# EAGLE schematic 1 Strain Gauge Board (EAGLE 9.1.3)
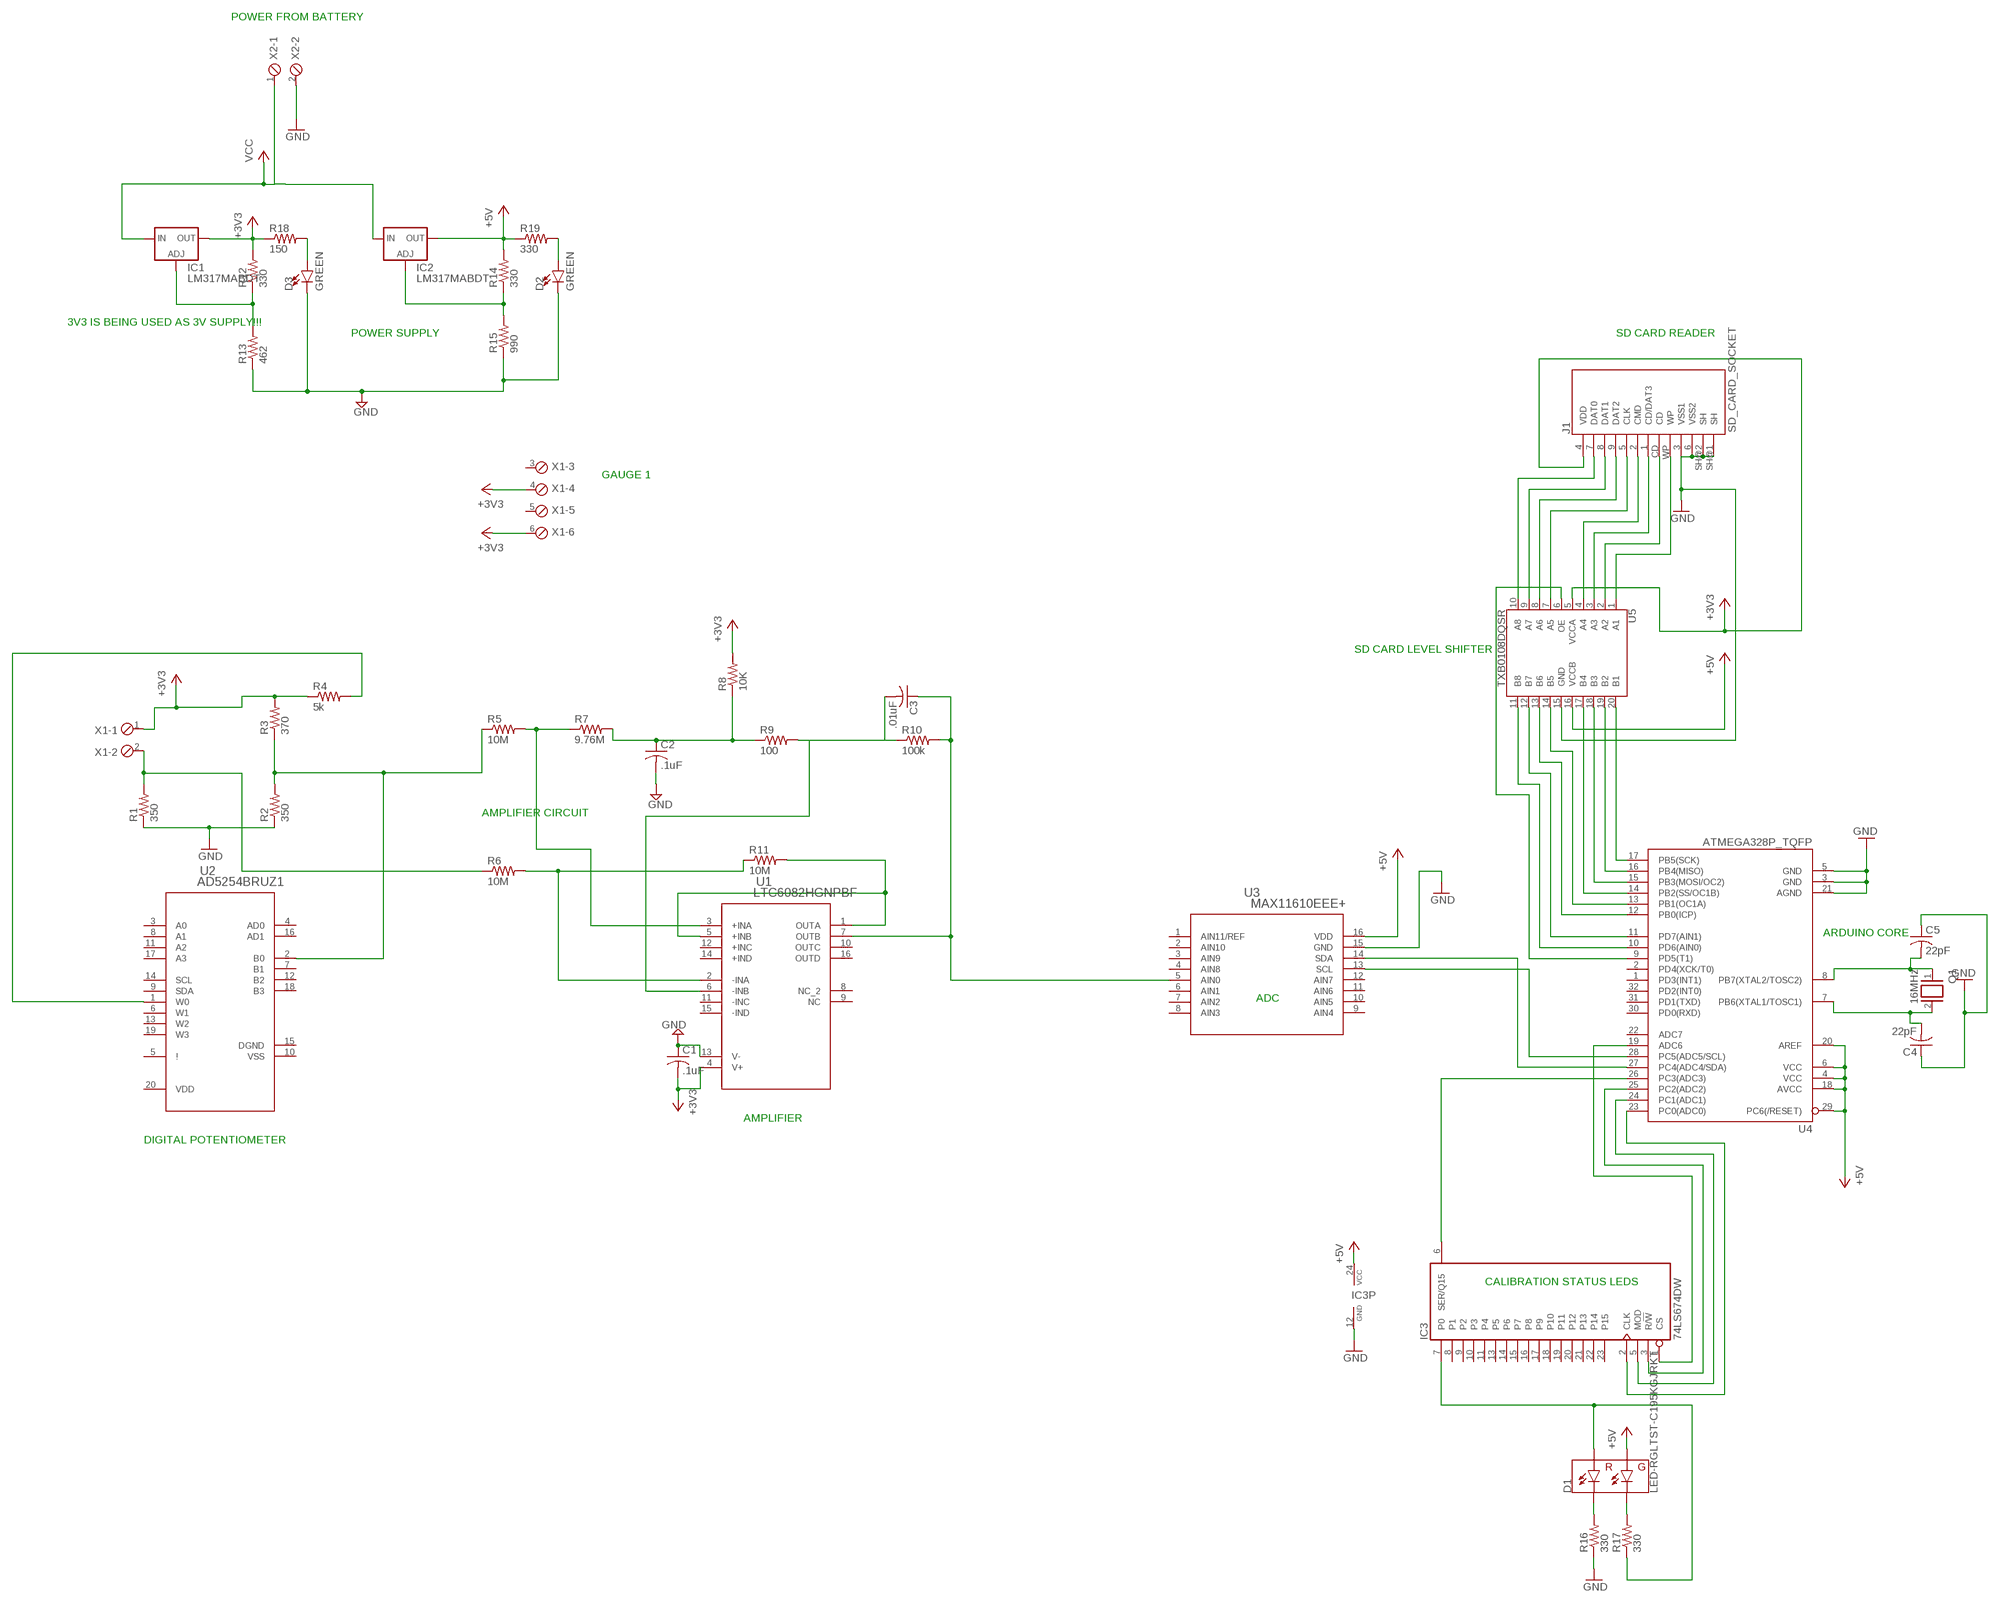
[diagram p0: schematic, sheet 1]

## Parts
C1  .1uF  C-USC1206K  [C1206K]
C2  .1uF  C-USC1206K  [C1206K]
C3  .01uF  C-USC1206K  [C1206K]
C4  22pF  C-USC1206K  [C1206K]
C5  22pF  C-USC1206K  [C1206K]
D1  LED-RGLTST-C195KGJRKT  [LTST-C195KGJRKT]
D2  GREEN  LED-GREEN1206  [LED-1206]
D3  GREEN  LED-GREEN1206  [LED-1206]
IC1  LM317MABDT  [DPACK]
IC2  LM317MABDT  [DPACK]
IC3  74LS674DW  [SO24W]
J1  SD_CARD_SOCKET  [SD]
Q1  16MHz  XTAL/S  [QS]
R1  350  R-US_M1206  [M1206]
R2  350  R-US_M1206  [M1206]
R3  370  R-US_M1206  [M1206]
R4  5k  R-US_M1206  [M1206]
R5  10M  R-US_M1206  [M1206]
R6  10M  R-US_M1206  [M1206]
R7  9.76M  R-US_M1206  [M1206]
R8  10K  R-US_M1206  [M1206]
R9  100  R-US_M1206  [M1206]
R10  100k  R-US_M1206  [M1206]
R11  10M  R-US_M1206  [M1206]
R12  330  R-US_M1206  [M1206]
R13  462  R-US_M1206  [M1206]
R14  330  R-US_M1206  [M1206]
R15  990  R-US_M1206  [M1206]
R16  330  R-US_M1206  [M1206]
R17  330  R-US_M1206  [M1206]
R18  150  R-US_M1206  [M1206]
R19  330  R-US_M1206  [M1206]
U1  LTC6082HGNPBF  [SSOP-16_GN]
U2  AD5254BRUZ1  [RU_20]
U3  MAX11610EEE+  [21-0055H_16]
U4  ATMEGA328P_TQFP  [TQFP32-08]
U5  TXB0108DQSR  TXB0108  [UFDFN-20]
X1  MPT6  [6POL254]
X2  MPT2  [2POL254]

## Nets
+3V3: C1.2 IC1.4(OUT) J1.4(VDD) R3.2 R4.1 R8.2 R12.2 R18.1 U1.4(V+) U5.5(VCCA) X1.1 X1.4 X1.6
+5V: D1.P$1(GA) IC2.4(OUT) IC3.24(VCC) R14.2 R19.1 U3.16(VDD) U4.4(VCC) U4.6(VCC) U4.18(AVCC) U4.20(AREF) U4.29(PC6(/RESET)) U5.16(VCCB)
GND: C1.1 C2.2 C4.1 C5.1 D2.C D3.C IC3.12(GND) J1.3(VSS1) J1.6(VSS2) J1.SH@1(SH) J1.SH@2(SH) R1.1 R2.1 R13.1 R15.1 R16.1 U1.13(V-) U3.15(GND) U4.3(GND) U4.5(GND) U4.21(AGND) U5.15(GND) X2.2
N$1: R2.2 R3.1 R5.1 U2.2(B0)
N$2: R1.2 R6.1 X1.2
N$3: R6.2 R11.1 U1.2(-INA)
N$4: R11.2 U1.1(OUTA) U1.5(+INB)
N$5: R4.2 U2.1(W0)
N$6: R5.2 R7.1 U1.3(+INA)
N$7: C2.1 R7.2 R8.1 R9.1
N$8: C3.2 R9.2 R10.1 U1.6(-INB)
N$9: C3.1 R10.2 U1.7(OUTB) U3.5(AIN0)
N$10: U3.14(SDA) U4.27(PC4(ADC4/SDA))
N$11: U3.13(SCL) U4.28(PC5(ADC5/SCL))
N$12: IC1.1(ADJ) R12.1 R13.2
N$13: J1.1(CD/DAT3) U5.3(A3)
N$14: IC2.1(ADJ) R14.1 R15.2
N$15: J1.WP U5.1(A1)
N$16: U4.9(PD5(T1)) U5.6(OE)
N$17: J1.CD U5.2(A2)
N$18: J1.2(CMD) U5.4(A4)
N$19: C4.2 Q1.2 U4.7(PB6(XTAL1/TOSC1))
N$20: C5.2 Q1.1 U4.8(PB7(XTAL2/TOSC2))
N$21: J1.5(CLK) U5.7(A5)
N$22: J1.9(DAT2) U5.8(A6)
N$23: J1.8(DAT1) U5.9(A7)
N$24: J1.7(DAT0) U5.10(A8)
N$25: D1.P$4(RC) R16.2
N$26: D1.P$3(GC) R17.2
N$27: D1.P$2(RA) IC3.7(P0) R17.1
N$28: U4.17(PB5(SCK)) U5.20(B1)
N$29: U4.16(PB4(MISO)) U5.19(B2)
N$30: U4.15(PB3(MOSI/OC2)) U5.18(B3)
N$31: U4.14(PB2(SS/OC1B)) U5.17(B4)
N$32: U4.13(PB1(OC1A)) U5.14(B5)
N$33: U4.12(PB0(ICP)) U5.13(B6)
N$34: U4.11(PD7(AIN1)) U5.12(B7)
N$35: U4.10(PD6(AIN0)) U5.11(B8)
N$36: IC3.6(SER/Q15) U4.26(PC3(ADC3))
N$37: IC3.2(CLK) U4.23(PC0(ADC0))
N$38: IC3.5(MOD) U4.24(PC1(ADC1))
N$39: IC3.3(R/!W) U4.25(PC2(ADC2))
N$40: IC3.1(CS) U4.19(ADC6)
N$43: D3.A R18.2
N$44: D2.A R19.2
VCC: IC1.3(IN) IC2.3(IN) X2.1
Unconnected: IC3.8(P1) IC3.9(P2) IC3.10(P3) IC3.11(P4) IC3.13(P5) IC3.14(P6) IC3.15(P7) IC3.16(P8) IC3.17(P9) IC3.18(P10) IC3.19(P11) IC3.20(P12) IC3.21(P13) IC3.22(P14) IC3.23(P15) U1.8(NC_2) U1.9(NC) U1.10(OUTC) U1.11(-INC) U1.12(+INC) U1.14(+IND) U1.15(-IND) U1.16(OUTD) U2.3(A0) U2.4(AD0) U2.5(!) U2.6(W1) U2.7(B1) U2.8(A1) U2.9(SDA) U2.11(A2) U2.12(B2) U2.13(W2) U2.14(SCL) U2.15(DGND) U2.16(AD1) U2.17(A3) U2.18(B3) U2.19(W3) U3.1(AIN11/REF) U3.2(AIN10) U3.3(AIN9) U3.4(AIN8) U3.6(AIN1) U3.7(AIN2) U3.8(AIN3) U3.9(AIN4) U3.10(AIN5) U3.11(AIN6) U3.12(AIN7) U4.1(PD3(INT1)) U4.2(PD4(XCK/T0)) U4.22(ADC7) U4.30(PD0(RXD)) U4.31(PD1(TXD)) U4.32(PD2(INT0)) X1.3 X1.5

## Notes on the sheet
- POWER FROM BATTERY
- 3V3 IS BEING USED AS 3V SUPPLY!!!
- POWER SUPPLY | SD CARD READER
- GAUGE 1
- SD CARD LEVEL SHIFTER
- AMPLIFIER CIRCUIT
- ARDUINO CORE
- ADC
- AMPLIFIER
- DIGITAL POTENTIOMETER
- CALIBRATION STATUS LEDS

## Power pins joined to a net without a drawn wire
VDD: U2.20(VDD)
VSS: U2.10(VSS)

## Library data of the parts
C1-C5 = resistor:C-US: CAPACITOR, American symbol
D1 = SparkFun-LED:LED-RG: LiteOn Technology Corporation LTST-C195KGJRKT - LED GREEN/RED CLEAR 0606 SMD Color: Red/Green Lens Transparency: Clear Lens Style/Size: Rectangle with Flat top, 1.10 x 1.5 mm mC Rating45mcd Red, 35 mcd Green Current: 20mA Red, 20mA Green Forward Voltage: 2V Red, 2V Green Packages: 0606 SparkFun Products: Electric Imp imp002 Breakout <[https://www.sparkfun.com/products/12958]>; PROD_ID: DIO-12140
D2 D3 = SparkFun-LED:LED-GREEN: Green SMD LED Used in manufacturing of various products at SparkFun Packages: 0603 - SMD 0603 package [Product Link] <http://www.futureelectronics.com/en/technologies/semiconductors/optoelectronics/leds/Pages/9894312-LTST-C190GKT.aspx?CrossPart=HSMG-C190&IM=0> LilyPad 1206 - SMD1206 LilyPad package [Product Link] <http://www.futureelectronics.com/en/Technologies/Product.aspx?ProductID=IN150NGHARVATEKCORPORATION2049943&IM=0> 1206 - SMD1206 package [Product Link] <http://www.futureelectronics.com/en/technologies/semiconductors/optoelectronics/leds/Pages/8315665-LTST-C150KGKT.aspx?IM=0> 1206 Bottom Mount -SMD 1206 Bottom Mount [Product Link] <http://www.digikey.com/product-detail/en/lite-on-inc/LTST-C230KGKT/160-1456-1-ND/386854> SparkFun Products: Pro Mini 328 -5V <https://www.sparkfun.com/products/821> RedBoard <https://www.sparkfun.com/products/12757> MP3 Trigger <https://www.sparkfun.com/products/13720> Makey Makey <https://www.sparkfun.com/products/11076>; PROD_ID: DIO-00862
IC1 IC2 = v-reg:LM317?*: 500 mA Adjustable Output Positive Voltage Regulator Source: http://www.onsemi.co.jp .. LM317M-D.PDF
IC3 = 74xx-eu:74*674: 16-bit SHIFT REGISTER parallel to serial conversion
J1 = SparkFun-Connectors:SD_CARD_SOCKET: SD Memory Card Connector (standard "large" size) Push-push normal type, CD enable, WP enable. Here is the connector we sell at SparkFun: SD/MMC Socket <https://www.sparkfun.com/products/12769> (PRT-12769) Datasheet <https://cdn.sparkfun.com/datasheets/Prototyping/19608.pdf> It is used on these SparkFun products: SparkFun SD/MMC Card Breakout <https://www.sparkfun.com/products/12941> (BOB-12941) SD Sniffer <https://www.sparkfun.com/products/11468> (TOL-11468); PROD_ID: CONN-11976; SF_ID: PRT-12769
Q1 = special:XTAL/S: CRYSTAL
R1-R19 = resistor:R-US_: RESISTOR, American symbol
U1 = LTC6082 Strain Gauge Amplifier:LTC6082HGNPBF; MANUFACTURER_PART_NUMBER: LTC6082HGN#PBF; VENDOR: Linear Technology
U2 = AD5254 4x1k Digital Potentiometer:AD5254BRUZ1; MANUFACTURER_PART_NUMBER: AD5254BRUZ1; VENDOR: Analog Devices Inc
U3 = MAX11610 10 bit ADC:MAX11610EEE+; MANUFACTURER_PART_NUMBER: MAX11610EEE+; VENDOR: Maxim Integrated Products
U4 = SparkFun-IC-Microcontroller:ATMEGA328P_TQFP: Popular 328P in QFP Storefront component: ATmega328 - TQFP <https://www.sparkfun.com/products/13448> (COM-13448) Datasheet <http://www.sparkfun.com/datasheets/Components/SMD/ATMega328.pdf> SparkFun Products SparkFun RedBoard - Programmed with Arduino <https://www.sparkfun.com/products/12757> (DEV-12757) Arduino Pro Mini 328 - 5V/16MHz <https://www.sparkfun.com/products/11113> (DEV-11113) Arduino Pro Mini 328 - 3.3V/8MHz <https://www.sparkfun.com/products/11114> (DEV-11114) SparkFun OpenLog <https://www.sparkfun.com/products/13712> (DEV-13712) SparkFun MicroView - OLED Arduino Module <https://www.sparkfun.com/products/12923> (DEV-12923) SparkFun Digital Sandbox <https://www.sparkfun.com/products/12651> (DEV-12651) SparkFun PicoBoard <https://www.sparkfun.com/products/11888> (WIG-11888) Arduino Fio <https://www.sparkfun.com/products/10116> (DEV-10116) LilyPad Arduino 328 Main Board <https://www.sparkfun.com/products/13342> (DEV-13342) SparkFun RedStick <https://www.sparkfun.com/products/13741> (DEV-13741) LilyPad MP3 <https://www.sparkfun.com/products/11013> (DEV-11013) LilyPad Arduino SimpleSnap <https://www.sparkfun.com/products/10941> (DEV-10941) SparkFun Stepoko <https://www.sparkfun.com/products/13899> (ROB-13899) SparkFun Geiger Counter <https://www.sparkfun.com/products/11345> (SEN-11345) SparkFun EL Sequencer <https://www.sparkfun.com/products/12781> (COM-12781) Arduino Pro 328 - 5V/16MHz <https://www.sparkfun.com/products/10915> (DEV-10915) CryptoCape <https://www.sparkfun.com/products/12773> (DEV-12773) SparkFun IR Thermometer Evaluation Board - MLX90614 <https://www.sparkfun.com/products/10740> (SEN-10740) SparkFun RedBot Mainboard <https://www.sparkfun.com/products/12097> (ROB-12097) Arduino Pro 328 - 3.3V/8MHz <https://www.sparkfun.com/products/10914> (DEV-10914) SparkFun Block for Intel® Edison - Arduino <https://www.sparkfun.com/products/13036> (DEV-13036) SparkFun Simon Says - Surface Mount Soldering Kit <https://www.sparkfun.com/products/10935> (KIT-10935) SparkFun 7-Segment Serial Display - Red <https://www.sparkfun.com/products/11441> (COM-11441) SparkFun 7-Segment Serial Display - White <https://www.sparkfun.com/products/11629> (COM-11629) SparkFun 7-Segment Serial Display - Yellow <https://www.sparkfun.com/products/11443> (COM-11443) SparkFun 7-Segment Serial Display - Kelly Green <https://www.sparkfun.com/products/11440> (COM-11440) SparkFun 7-Segment Serial Display - Blue <https://www.sparkfun.com/products/11442> (COM-11442) SparkFun OpenSegment Serial Display - 20mm (Blue) <https://www.sparkfun.com/products/11647> (COM-11647) SparkFun OpenSegment Serial Display - 20mm (Green) <https://www.sparkfun.com/products/11646> (COM-11646) SparkFun OpenSegment Serial Display - 20mm (White) <https://www.sparkfun.com/products/11648> (COM-11648) SparkFun OpenSegment Serial Display - 20mm (Red) <https://www.sparkfun.com/products/11644> (COM-11644) SparkFun OpenSegment Serial Display - 20mm (Yellow) <https://www.sparkfun.com/products/11645> (COM-11645) SparkFun OpenSegment Shield <https://www.sparkfun.com/products/13190> (DEV-13190); PROD_ID: IC-09069
U5 = SparkFun-IC-Comms:TXB0108: 8-Bit Bi-Directional Level Shifter 1.2V-3.6V (VCCA) to 1.65V-5.5V (VCCB) bi-directional level shifter with auto direction sensing. Max data rate - VCCA 1.2V: 20Mbps (50ns), VCCA 3.3V: 100Mbps (10ns) Digikey: 296-27217-1-ND (20-UFDFN) SparkFun Products SparkFun GPS Logger Shield <https://www.sparkfun.com/products/13750> (GPS-13750) SparkFun Block for Intel® Edison - microSD <https://www.sparkfun.com/products/13041> (DEV-13041) SparkFun Block for Intel® Edison - Dual H-Bridge <https://www.sparkfun.com/products/13043> (DEV-13043) SparkFun Block for Intel® Edison - GPIO <https://www.sparkfun.com/products/13038> (DEV-13038) SparkFun Block for Intel® Edison - Raspberry Pi B <https://www.sparkfun.com/products/13044> (DEV-13044); PROD_ID: IC-12292
X1 = con-phoenix-254:MPT6: PHOENIX CONNECTOR; OC_FARNELL: unknown; OC_NEWARK: unknown
X2 = con-phoenix-254:MPT2: PHOENIX CONNECTOR; OC_FARNELL: unknown; OC_NEWARK: unknown